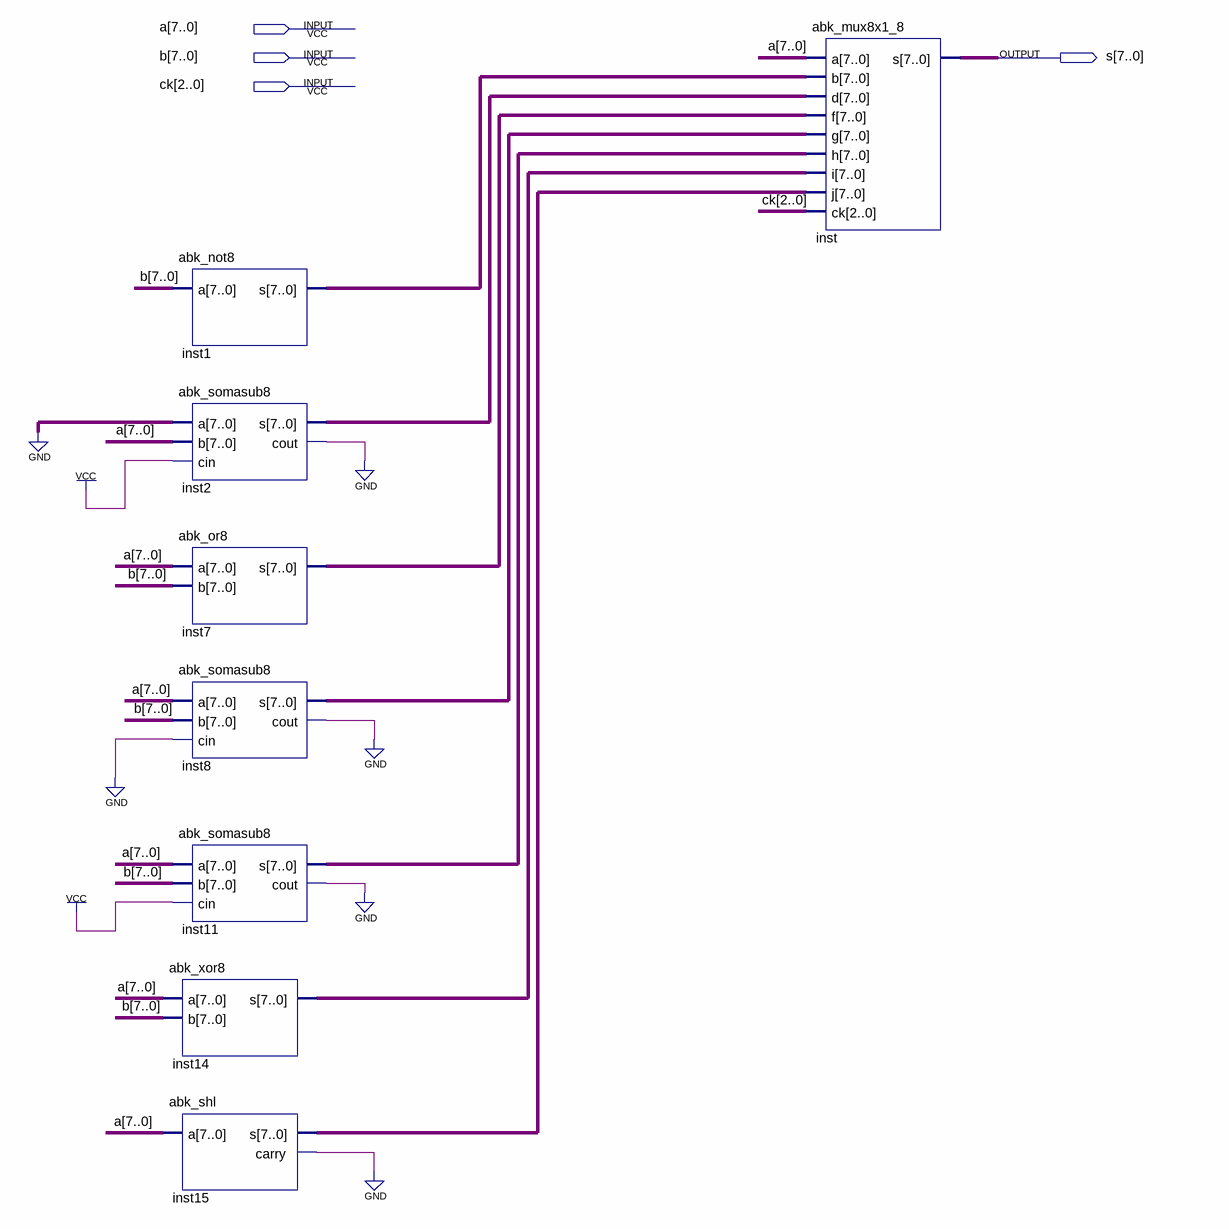
[diagram p0: schematic sheet]
// Quartus schematic abk_ula_generica.bdf as structural Verilog: 8 symbols, 4 pins
module abk_ula_generica (
  input  [7:0] a,
  input  [7:0] b,
  input  [2:0] ck,
  output [7:0] s
);

  wire inst2_cout, inst8_cout, inst11_cout, inst15_carry;
  wire [7:0] inst1_s, inst2_s, inst7_s, inst8_s, inst11_s, inst14_s, inst15_s;

  abk_not8 inst1 (.a(b), .s(inst1_s));
  abk_somasub8 inst2 (.a({8{1'b0}}), .b(a), .cin(1'b1), .s(inst2_s), .cout(inst2_cout));
  abk_or8 inst7 (.a(a), .b(b), .s(inst7_s));
  abk_somasub8 inst8 (.a(a), .b(b), .cin(1'b0), .s(inst8_s), .cout(inst8_cout));
  abk_somasub8 inst11 (.a(a), .b(b), .cin(1'b1), .s(inst11_s), .cout(inst11_cout));
  abk_xor8 inst14 (.a(a), .b(b), .s(inst14_s));
  abk_shl inst15 (.a(a), .s(inst15_s), .carry(inst15_carry));
  abk_mux8x1_8 inst (
    .a(a), .b(inst1_s), .d(inst2_s), .f(inst7_s), .g(inst8_s), .h(inst11_s), .i(inst14_s), .j(inst15_s),
    .ck(ck), .s(s));
  // also tied to GND on the sheet: {inst2_cout, inst8_cout, inst11_cout, inst15_carry}
endmodule
